# EAGLE design POV2.2 (EAGLE 6.5.0)
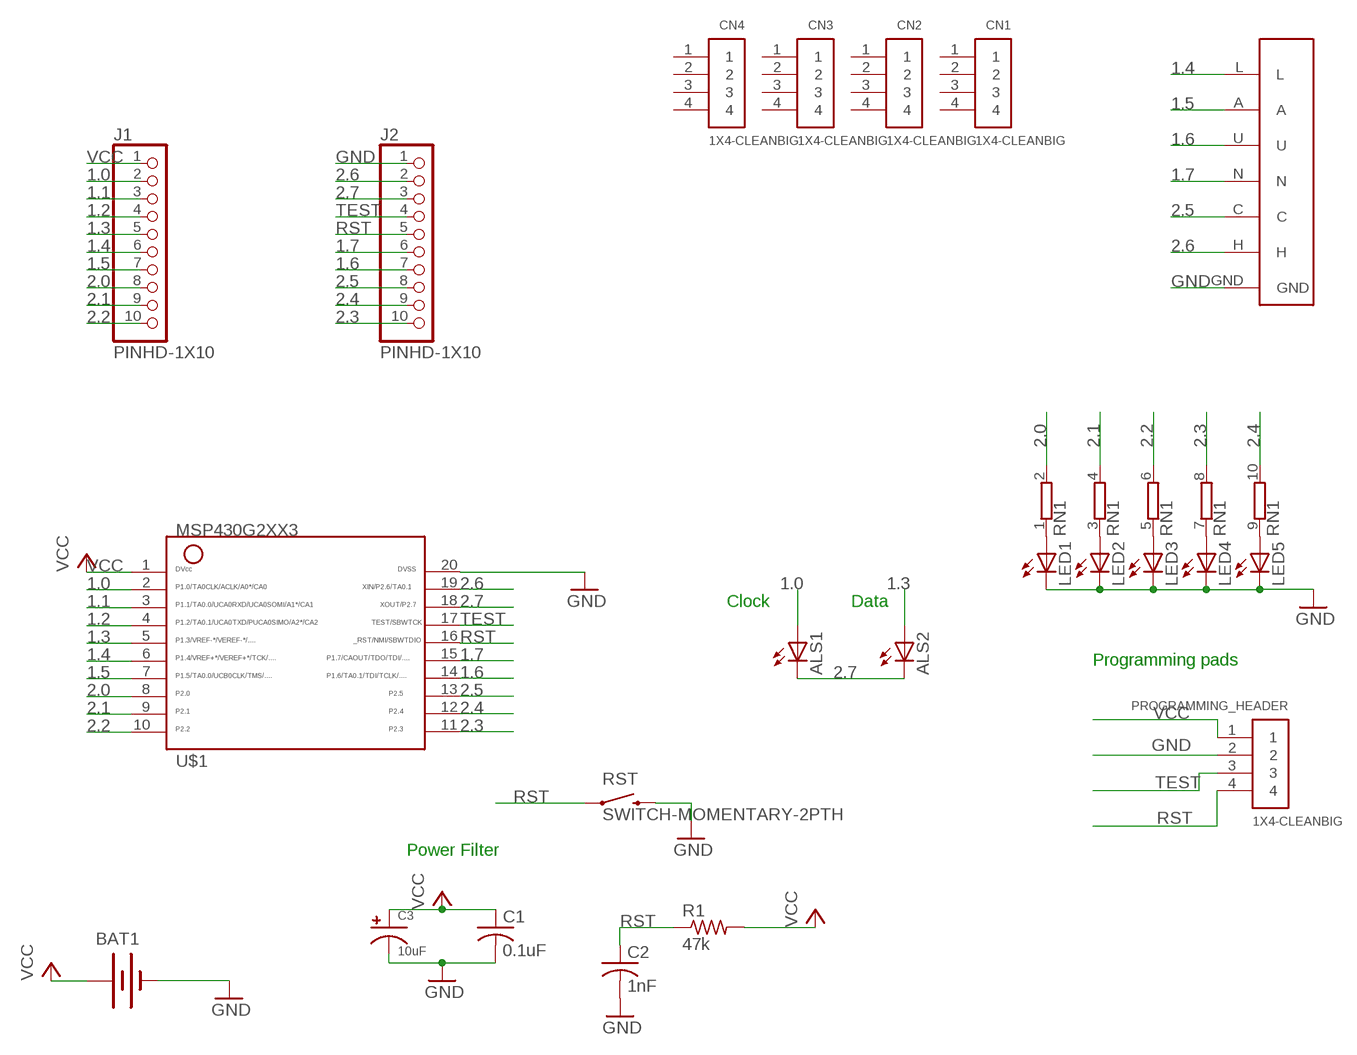
[diagram p0: schematic, sheet 1]

## Parts
ALS1  LED3MM  [LED3MM]
ALS2  LED3MM  [LED3MM]
BAT1  BATTERYELECROW_2032_BATTERY_HOLDER  [BATTCON_20MM_4LEGS]
C1  0.1uF  C-US025-024X044  [C025-024X044]
C2  1nF  C-US025-024X044  [C025-024X044]
C3  10uF  CPOL-US  [E2,5-5]
CN1  1X4-CLEANBIG  [1X04-CLEANBIG]
CN2  1X4-CLEANBIG  [1X04-CLEANBIG]
CN3  1X4-CLEANBIG  [1X04-CLEANBIG]
CN4  1X4-CLEANBIG  [1X04-CLEANBIG]
J1  PINHD-1X10  [1X10-BIG]
J2  PINHD-1X10  [1X10-BIG]
LED1  LED3MM  [LED3MM]
LED2  LED3MM  [LED3MM]
LED3  LED3MM  [LED3MM]
LED4  LED3MM  [LED3MM]
LED5  LED3MM  [LED3MM]
PROGRAMMING_HEADER  1X4-CLEANBIG  [1X04-CLEANBIG]
R1  47k  R-US_0204/7  [0204/7]
RN1  E5RP  [SIL10]
RST  SWITCH-MOMENTARY-2PTH  [TACTILE-PTH]
U$1  G2553  G2XX3---N20  [N20]
U$5  LAUNCH_SLIDER  [LAUNCHYOURDESIGN_CAPT_SLIDER]

## Nets
1.0: ALS1.A J1.2 U$1.2
1.1: J1.3 U$1.3
1.2: J1.4 U$1.4
1.3: ALS2.A J1.5 U$1.5
1.4: J1.6 U$1.6 U$5.L
1.5: J1.7 U$1.7 U$5.A
1.6: J2.7 U$1.14 U$5.U
1.7: J2.6 U$1.15 U$5.N
2.0: J1.8 RN1.2 U$1.8
2.1: J1.9 RN1.4 U$1.9
2.2: J1.10 RN1.6 U$1.10
2.3: J2.10 RN1.8 U$1.11
2.4: J2.9 RN1.10 U$1.12
2.5: J2.8 U$1.13 U$5.C
2.6: J2.2 U$1.19 U$5.H
2.7: ALS1.K(C) ALS2.K(C) J2.3 U$1.18
GND: BAT1.GND(-) C1.2 C2.2 C3.- J2.1 LED1.K(C) LED2.K(C) LED3.K(C) LED4.K(C) LED5.K(C) PROGRAMMING_HEADER.2 RST.3 RST.4 U$1.20 U$5.GND
N$1: LED1.A RN1.1
N$2: LED2.A RN1.3
N$3: LED3.A RN1.5
N$4: LED4.A RN1.7
N$5: LED5.A RN1.9
RST: C2.1 J2.5 PROGRAMMING_HEADER.4 R1.1 RST.1 RST.2 U$1.16
TEST: J2.4 PROGRAMMING_HEADER.3 U$1.17
VCC: BAT1.VCC1(+) BAT1.VCC2(+) C1.1 C3.+ J1.1 PROGRAMMING_HEADER.1 R1.2 U$1.1
Unconnected: CN1.1 CN1.2 CN1.3 CN1.4 CN2.1 CN2.2 CN2.3 CN2.4 CN3.1 CN3.2 CN3.3 CN3.4 CN4.1 CN4.2 CN4.3 CN4.4

## Notes on the sheet
- Clock | Data
- Programming pads
- Power Filter

## Library data of the parts
ALS1 ALS2 LED1-LED5 = led:LED: LED OSRAM: - CHIPLED LG R971, LG N971, LY N971, LG Q971, LY Q971, LO R971, LY R971 LH N974, LH R974 LS Q976, LO Q976, LY Q976 LO Q996 - Hyper CHIPLED LW Q18S LB Q993, LB Q99A, LB R99A - SideLED LS A670, LO A670, LY A670, LG A670, LP A670 LB A673, LV A673, LT A673, LW A673 LH A674 LY A675 LS A676, LA A676, LO A676, LY A676, LW A676 LS A679, LY A679, LG A679 - Hyper Micro SIDELED® LS Y876, LA Y876, LO Y876, LY Y876 LT Y87S - SmartLED LW L88C, LW L88S LB L89C, LB L89S, LG L890 LS L89K, LO L89K, LY L89K LS L896, LA L896, LO L896, LY L896 - TOPLED LS T670, LO T670, LY T670, LG T670, LP T670 LSG T670, LSP T670, LSY T670, LOP T670, LYG T670 LG T671, LOG T671, LSG T671 LB T673, LV T673, LT T673, LW T673 LH T674 LS T676, LA T676, LO T676, LY T676, LB T676, LH T676, LSB T676, LW T676 LB T67C, LV T67C, LT T67C, LS T67K, LO T67K, LY T67K, LW E67C LS E67B, LA E67B, LO E67B, LY E67B, LB E67C, LV E67C, LT E67C LW T67C LS T679, LY T679, LG T679 LS T770, LO T770, LY T770, LG T770, LP T770 LB T773, LV T773, LT T773, LW T773 LH T774 LS E675, LA E675, LY E675, LS T675 LS T776, LA T776, LO T776, LY T776, LB T776 LHGB T686 LT T68C, LB T68C - Hyper Mini TOPLED® LB M676 - Mini TOPLED Santana® LG M470 LS M47K, LO M47K, LY M47K Source: http://www.osram.convergy.de LUXEON: - LUMILED® LXK2-PW12-R00, LXK2-PW12-S00, LXK2-PW14-U00, LXK2-PW14-V00 LXK2-PM12-R00, LXK2-PM12-S00, LXK2-PM14-U00 LXK2-PE12-Q00, LXK2-PE12-R00, LXK2-PE12-S00, LXK2-PE14-T00, LXK2-PE14-U00 LXK2-PB12-K00, LXK2-PB12-L00, LXK2-PB12-M00, LXK2-PB14-N00, LXK2-PB14-P00, LXK2-PB14-Q00 LXK2-PR12-L00, LXK2-PR12-M00, LXK2-PR14-Q00, LXK2-PR14-R00 LXK2-PD12-Q00, LXK2-PD12-R00, LXK2-PD12-S00 LXK2-PH12-R00, LXK2-PH12-S00 LXK2-PL12-P00, LXK2-PL12-Q00, LXK2-PL12-R00 Source: www.luxeon.com KINGBRIGHT: KA-3528ASYC Source: www.kingbright.com
BAT1 = TIBadgeCustom:BATTERY
C1 C2 = rcl:C-US: CAPACITOR, American symbol
C3 = TIBadgeCustom:CPOL-US
CN1-CN4 = adafruit:1X4: 4-pin connector
J1 J2 = adafruit:PINHD-1X10: Pin header 1x10 0.1" spacing With round pins
PROGRAMMING_HEADER = TIBadgeCustom:1X4: 4-pin connector
R1 = TIBadgeCustom:R-US_: RESISTOR, American symbol
RN1 = resistor-sil:E5RP: SIL RESISTOR; OC_FARNELL: unknown; OC_NEWARK: unknown
RST = Sparkfun:SWITCH-MOMENTARY-2
U$1 = TI_MSP430_v16:G2XX3---N20: MSP430G2XX1 PDIP (N) 20 Pin Package
U$5 = TIBadgeCustom:LAUNCH_SLIDER

## Board
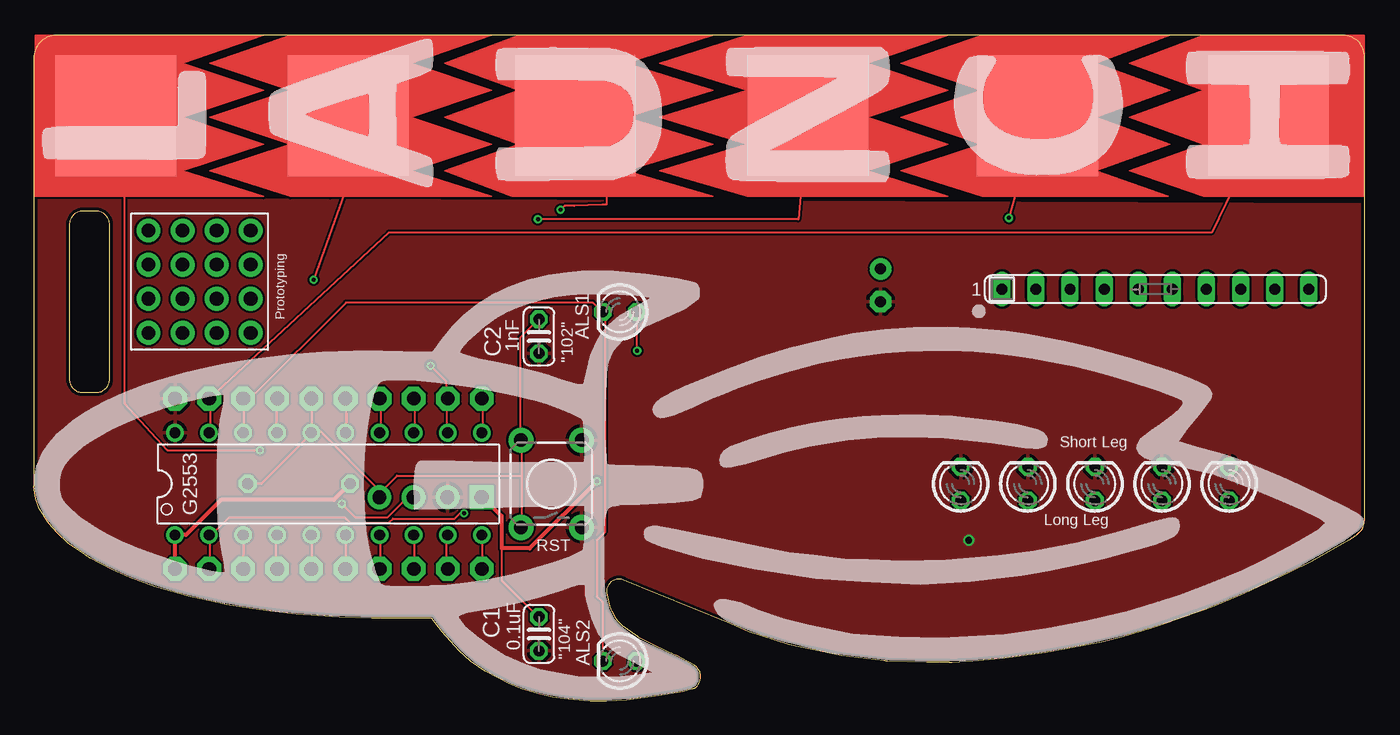
[diagram p1: board, top side]
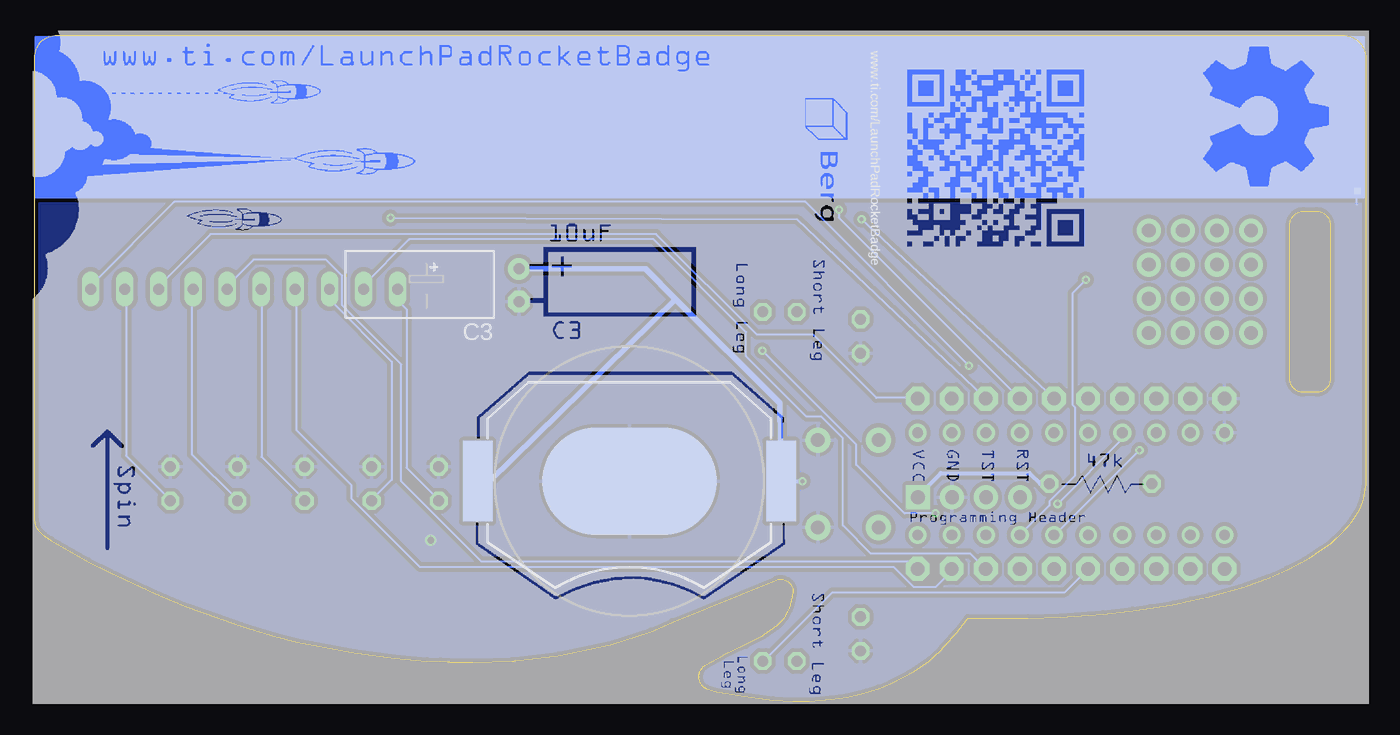
[diagram p2: board, bottom side, seen from below]

Size 99.15 x 49.6 mm. Coordinates in mm from the lower left corner, seen from the top.
Outline: 2.65,35.5 2.65,24 arc90 3.65,23 4.65,23 arc90 5.65,24 5.65,35.5 arc90 4.65,36.5 3.65,36.5 arc90 2.65,35.5
Copper layers (1*16): Top 0.035mm / dielectric 1.5mm / Bottom 0.035mm
Design rules "Elecrow_2-layer_eagle_rule *": minimum track width 6mil, minimum drill 12mil, track to track 6mil, track to pad 6mil, pad to pad 6mil, via to via 6mil, smd to smd 0mil, copper to edge 10mil, drill to drill 10mil, minimum pad ring 10mil, minimum via ring 6mil, stop-mask expansion 2mil, vias tented up to drill 10mm, thermal gap 10mil

### Footprints (pad centres in the part's own frame; a part is rotated, then mirrored left to right if it is on the bottom)
LED3MM = drill 0.813 octagon: A -1.27,0; K 1.27,0
BATTCON_20MM_4LEGS = smd 13 x 8: GND 0,0 | smd 2.2 x 6: VCC1 -11.3,0; VCC2 11.3,0
C025-024X044 = drill 0.813 octagon: 1 -1.27,0; 2 1.27,0
E2,5-5 = drill 0.813 pad 1.6: + 0.005,-1.21 | drill 0.813 pad 1.6 octagon: - 0.005,1.23
1X04-CLEANBIG = drill 1.016 pad 1.778: 1 -3.81,0; 2 -1.27,0; 3 1.27,0; 4 3.81,0
1X10-BIG = drill 1.016 pad 1.778 octagon: 1 -11.43,0; 2 -8.89,0; 3 -6.35,0; 4 -3.81,0; 5 -1.27,0; 6 1.27,0; 7 3.81,0; 8 6.35,0; 9 8.89,0; 10 11.43,0
1X04-CLEANBIG' = drill 1.016 pad 1.778 square: 1 -3.81,0 | drill 1.016 pad 1.778: 2 -1.27,0; 3 1.27,0; 4 3.81,0
0204/7 = drill 0.813 octagon: 1 -3.81,0; 2 3.81,0
SIL10 = drill 0.813 long: 1 -11.43,0; 2 -8.89,0; 3 -6.35,0; 4 -3.81,0; 5 -1.27,0; 6 1.27,0; 7 3.81,0; 8 6.35,0; 9 8.89,0; 10 11.43,0
TACTILE-PTH = drill 1.016 pad 1.88: 1 -3.251,2.261; 2 3.251,2.261; 3 -3.251,-2.261; 4 3.251,-2.261
N20 = drill 0.813: 1 -11.435,-3.81; 2 -8.895,-3.81; 3 -6.355,-3.81; 4 -3.815,-3.81; 5 -1.275,-3.81; 6 1.265,-3.81; 7 3.805,-3.81; 8 6.345,-3.81; 9 8.885,-3.81; 10 11.425,-3.81; 11 11.425,3.81; 12 8.885,3.81; 13 6.345,3.81; 14 3.805,3.81; 15 1.265,3.81; 16 -1.275,3.81; 17 -3.815,3.81; 18 -6.355,3.81; 19 -8.895,3.81; 20 -11.435,3.81
LAUNCHYOURDESIGN_CAPT_SLIDER = smd 9 x 9: A 6.1,75.7; C 6.1,24.35; H 6.1,7.13; L 6.1,93; N 6.1,41.43; U 6.1,58.77 | smd 0.5 x 0.5 bottom: GND 0.5,98.5

### Placement (x,y rotation side)
ALS1  43.65,29 180 top
ALS2  43.65,3 180 top
BAT1  54.85,16.4 180 bottom
C1  37.63,5.02 270 top
C2  37.63,27.18 270 top
C3  63.07,31 180 bottom
CN1  12.35,32.52 0 top
CN2  12.35,35.06 0 top
CN3  12.35,29.98 0 top
CN4  12.35,27.44 0 top
J1  21.95,9.86 0 top
J2  21.95,22.54 0 top
LED1  69.05,16.2 90 top
LED2  74.05,16.2 90 top
LED3  79.05,16.2 90 top
LED4  84.05,16.2 90 top
LED5  89.05,16.2 90 top
PROGRAMMING_HEADER  1X4-CLEANBIG  [1X04-CLEANBIG']  29.55,15.2 0 bottom
R1  19.75,16.2 180 bottom
RN1  83.55,30.7 0 top
RST  38.55,16.2 90 top
U$1  21.95,16.2 0 top
U$2  [ROCKET_WIDER_V3]  99.55,0.6 90 top
U$4  [TI_BADGE_QR]  35.75,48.64 270 bottom
U$5  99.11,37.5 90 top
U$6  [LAUNCH_CIRCUIT_OVERLAY2]  99.15,37.5 90 top

### Tracks (layer width: path | path; a pad name or v marks a point on that pad's centre or on a via)
1.0  (via drill 0.3)
  Top 0.152: 13.15,12.3 13.15,9.9 J1.2 | v44.95,26.1 44.95,29 ALS1.A | v32.05,14 31.75,14 31.35,13.6 26.75,13.6 26.45,13.3 23.55,13.3 23.15,13.7 14.55,13.7 13.15,12.3 | 13.15,12.3 U$1.2
  Bottom 0.152: v44.95,26.1 37.95,19.1 37.95,17.6 34.35,14 v32.05,14
1.1
  Top 0.152: U$1.3 15.65,12.3 15.65,9.9 J1.3
1.2
  Top 0.152: U$1.4 18.05,12.3 18.05,9.9 J1.4
1.3
  Top 0.152: U$1.5 20.75,12.3 20.75,9.9 J1.5
  Bottom 0.152: ALS2.A 44.85,3 39.75,8.1 22.45,8.1 20.75,9.8 J1.5
1.4  (via drill 0.3)
  Top 0.152: U$1.6 23.25,12.3 23.25,9.9 J1.6 | v16.85,18.7 9.95,18.7 6.75,22.2 6.75,43.3 6.15,43.6 U$5.L
  Bottom 0.152: v16.85,18.7 23.15,12.4 U$1.6
1.5  (via drill 0.3)
  Top 0.152: U$1.7 25.85,12.3 25.85,9.9 J1.7 | v20.85,31.4 23.35,38.4 23.35,43.6 U$5.A
  Bottom 0.152: v20.85,31.4 21.85,30.4 21.85,22.1 21.65,21.9 21.65,16.8 23.55,14.9 23.55,14.6 U$1.7
1.6  (via drill 0.3)
  Top 0.152: U$1.14 25.85,20.1 25.85,22.5 J2.7 | U$5.U 42.65,43.5 42.65,36.99 42.34,36.99 40.25,36.9 39.55,36.9 v39.25,36.6
  Bottom 0.152: v39.25,36.6 39.25,36.03 J2.7
1.7  (via drill 0.3)
  Top 0.152: U$1.15 23.25,20.1 23.25,22.5 J2.6 | v37.55,35.9 56.95,35.9 57.65,43.6 U$5.N
  Bottom 0.152: v37.55,35.9 23.25,22.6 J2.6
2.0
  Top 0.152: U$1.8 28.35,12.3 28.35,9.9 J1.8
  Bottom 0.152: RN1.2 74.65,31 71.25,34.4 53.05,34.4 46.15,27.5 46.15,25.7 41.65,21.2 40.55,21.2 38.95,19.6 38.95,13.1 36.85,11 29.45,11 28.35,9.9 J1.8
2.1
  Top 0.152: U$1.9 30.75,12.3 30.75,9.9 J1.9
  Bottom 0.152: RN1.4 79.65,30.7 79.65,20.2 75.55,16.1 75.55,15.1 70.45,10 35.15,10 33.65,8.5 32.05,8.5 30.75,9.8 J1.9
2.2
  Top 0.152: U$1.10 33.45,12.3 33.45,9.9 J1.10
  Bottom 0.152: RN1.6 84.75,30.7 84.75,31 82.85,32.9 77.45,32.9 76.25,31.7 76.25,29.5 71.85,25.1 71.85,16.4 65.85,10.4 33.95,10.4 33.45,9.9 J1.10
2.3
  Top 0.152: U$1.11 33.45,20.1 33.45,22.5 J2.10
  Bottom 0.152: RN1.8 89.85,30.7 89.85,31 86.05,34.8 52.85,34.8 45.35,27.3 41.15,27.3 36.45,22.6 33.45,22.6 J2.10
2.4  (via drill 0.3)
  Top 0.152: U$1.12 30.75,20.1 30.75,22.5 J2.9 30.75,22.6 30.75,23.8 v29.55,25
  Bottom 0.152: v29.55,25 41.75,37.2 88.75,37.2 94.95,31 94.95,30.7 RN1.10
2.5  (via drill 0.3)
  Top 0.152: U$1.13 28.35,20.1 28.35,22.5 J2.8 | v72.65,36 U$5.C
  Bottom 0.152: v72.65,36 42.35,35.9 28.35,22.6 J2.8
2.6
  Top 0.152: U$1.19 13.15,20.1 13.15,22.5 J2.2 13.15,22.6 26.45,34.9 87.75,34.9 91.95,43.6 U$5.H
2.7
  Top 0.152: U$1.18 15.65,20.1 15.65,22.5 J2.3 15.65,22.6 16.15,22.6 23.25,29.7 41.65,29.7 42.35,29 ALS1.K 42.45,29 42.55,28.9 42.55,12.6 41.95,12 41.95,7.8 42.35,7.4 42.35,3 ALS2.K
GND  (via drill 0.5)
  Bottom 0.152: 0.65,37 0.65,38 U$5.GND
  other vias: 69.65,12
  pour Top: -4.35,37.5 108.15,37 107.15,-1 -2.35,-1 -2.35,2.5 -6.35,0
  pour Bottom (isolate 0.3): -2.35,37.5 107.65,37 107.65,-0.5 -1.35,-1.5 -1.35,3.5
N$1
  Bottom 0.152: LED1.A 69.05,15 71.45,17.4 71.45,29.2 72.05,29.8 72.05,30.7 RN1.1
N$2
  Bottom 0.152: LED2.A 74.05,15 72.55,16.5 72.55,25.3 77.15,29.9 77.15,30.7 RN1.3
N$3
  Bottom 0.152: LED3.A 79.05,15 82.25,18.2 82.25,30.7 RN1.5
N$4
  Bottom 0.152: LED4.A 84.05,15 87.45,18.4 87.45,30.7 RN1.7
N$5
  Bottom 0.152: LED5.A 89.05,15 92.35,18.3 92.35,30.7 RN1.9
RST
  Top 0.152: C2.1 37.55,28.4 36.25,27.1 36.25,19.5 RST.2 36.35,19.4 36.35,16.8 | 36.35,16.8 36.35,13 RST.1 | R1.1 16.95,16.2 20.75,20 U$1.16 20.75,20.1 | 25.65,15.4 25.65,15.8 21.35,20.1 20.75,20.1 | 25.65,15.4 25.65,15.2 PROGRAMMING_HEADER.4 25.65,15.4 | 20.75,20.1 20.75,22.5 J2.5 | 36.35,16.8 27.05,16.8 25.65,15.4
TEST  (via drill 0.3)
  Top 0.152: U$1.17 18.05,20.1 18.05,22.5 J2.4 | PROGRAMMING_HEADER.3 27.85,15.2 26.35,13.7 23.95,13.7 v22.95,14.7
  Bottom 0.152: v22.95,14.7 18.15,19.5 18.15,20 U$1.17
VCC  (via drill 0.3)
  Top 0.152: 10.55,12.3 U$1.1 10.55,12.4 | 10.55,9.9 J1.1 | 34.85,11.4 34.85,9 37.55,6.3 C1.1 | 33.45,15.2 PROGRAMMING_HEADER.1 | R1.2
  Top 0.305: 10.55,9.9 10.55,12.3 | 33.45,15.2 34.85,13.8 34.85,11.4 36.95,11.4 v41.95,16.4 | 10.55,12.4 11.35,12.4 13.95,15 22.35,15 R1.2
  Bottom 0.152: 33.45,15.2 PROGRAMMING_HEADER.1 | 65.25,16.4 BAT1.VCC2
  Bottom 0.305: R1.2 24.25,16.2 25.05,17 31.65,17 33.45,15.2 | BAT1.VCC1 v41.95,16.4
  Bottom 0.406: 51.4,29.95 43.65,22.2 BAT1.VCC1 | 51.4,29.95 65.25,16.4 | 51.4,29.95 53.66,32.21 C3.+

### Text on the board
tPlace: Prototyping | "102" | Short Leg | Long Leg | "104"